# EAGLE design Connecteur chargeur (EAGLE 5.10)
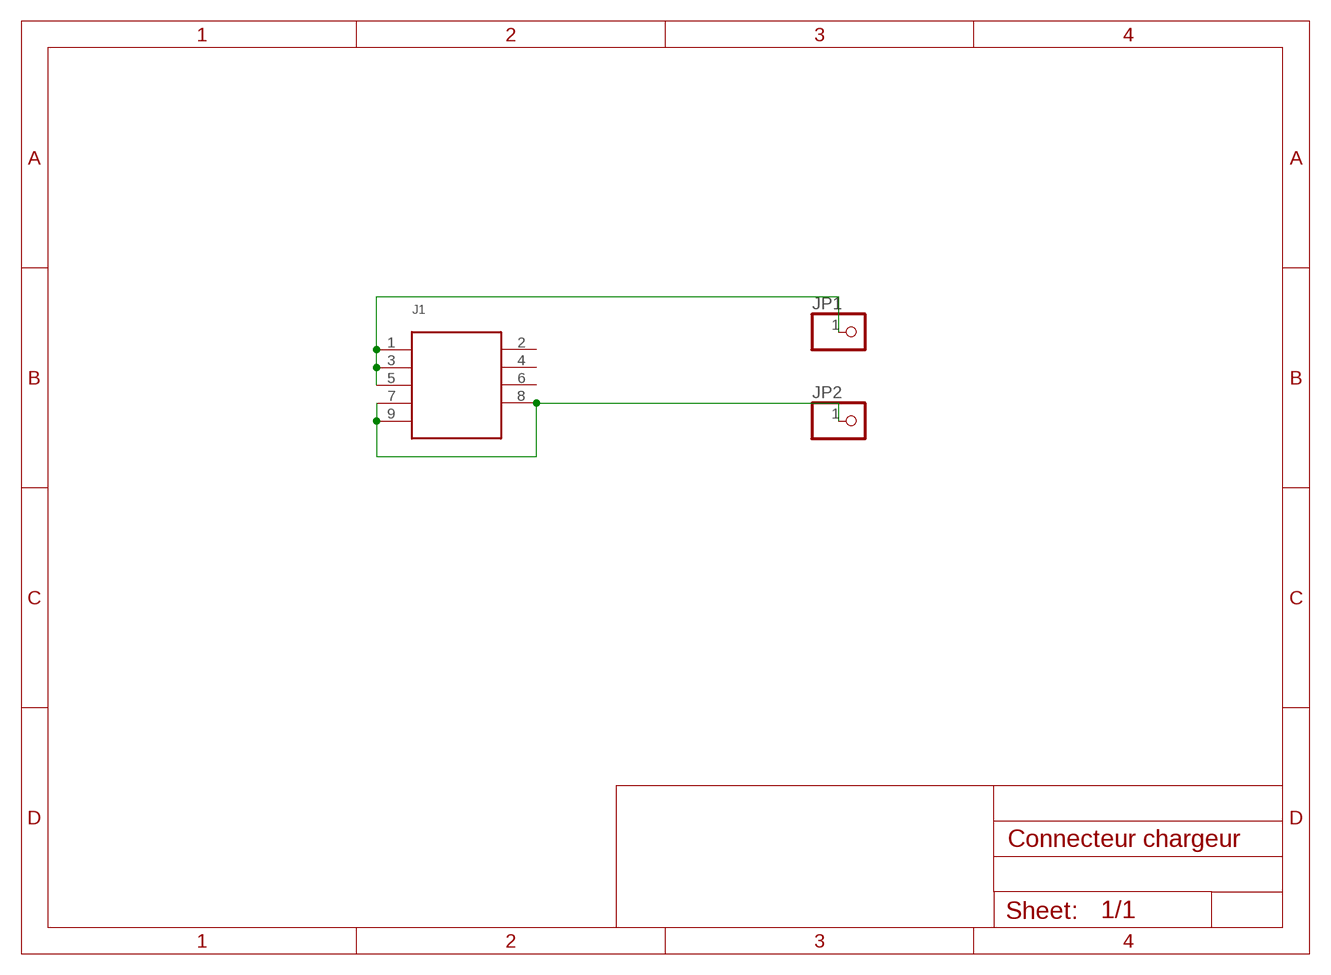
[diagram p0: schematic, sheet 1]

## Parts
J1  M40-9-M  [M40-600-9]
JP1  PINHD-1X1  [1X01]
JP2  PINHD-1X1  [1X01]

## Nets
GND: J1.7 J1.8 J1.9 JP2.1
VBAT: J1.1 J1.3 J1.5 JP1.1
Unconnected: J1.2 J1.4 J1.6

## Library data of the parts
J1 = con-harwing:M40-9
JP1 JP2 = pinhead:PINHD-1X1: PIN HEADER

## Board
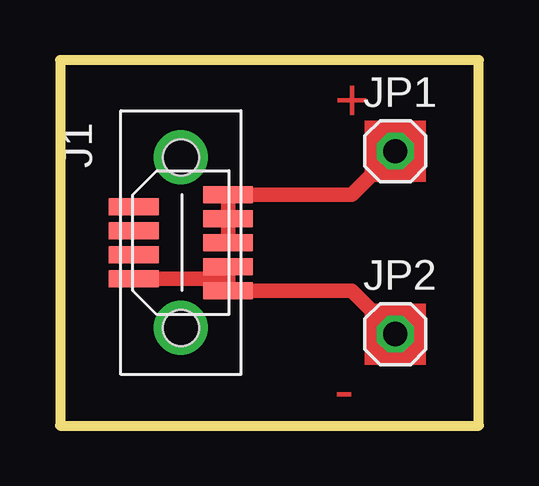
[diagram p1: board, top side]

Size 17.45 x 15.23 mm. Coordinates in mm from the lower left corner, seen from the top.
Outline: 0,0 17.45,0 17.45,15.23 0,15.23 0,0
Copper layers (1*16): Top 0.035mm / dielectric 1.5mm / Bottom 0.035mm
Design rules "default": minimum track width 10mil, minimum drill 24mil, track to track 8mil, track to pad 8mil, pad to pad 8mil, via to via 8mil, smd to smd 8mil, copper to edge 40mil, drill to drill 8mil, minimum pad ring 10mil, minimum via ring 8mil, stop-mask expansion 4mil, vias tented up to drill 0mil, thermal gap 10mil

### Footprints (pad centres in the part's own frame; a part is rotated, then mirrored left to right if it is on the bottom)
M40-600-9 = smd 0.7 x 2.08: 1 -2,1.92; 2 -1.5,-2; 3 -1,1.92; 4 -0.5,-2; 5 0,1.92; 6 0.5,-2; 7 1,1.92; 8 1.5,-2; 9 2,1.92 | drill 1.5 round: P$10 -3.55,-0.04; P$11 3.55,-0.04 | hole 1.5: -3.55,-0.04; 3.55,-0.04
1X01 = drill 1.016 octagon: 1 0,0

### Placement (x,y rotation side)
J1  5.08,7.62 270 top
JP1  13.97,11.43 0 top
JP2  13.97,3.81 0 top

### Tracks (layer width: path | path; a pad name or v marks a point on that pad's centre or on a via)
GND
  Top 0.61: J1.8 6.5,6.12 J1.9 | J1.9 J1.7 | J1.9 12.16,5.62 JP2.1
VBAT
  Top 0.61: J1.5 J1.3 J1.1 12.16,9.62 JP1.1
(copper drawn outside any net)
  shapes: Top area x2

### Text on the board
Top: + | -